# Altium schematic sheet Column.SchDoc
size 420 x 297 mm; Address1: Address1; Address2: Address2; Address3: Address3; Address4: Address4; DocumentNumber: *Э3; SheetNumber: 11; SheetTotal: 15; DocumentType: Схема электрическая *
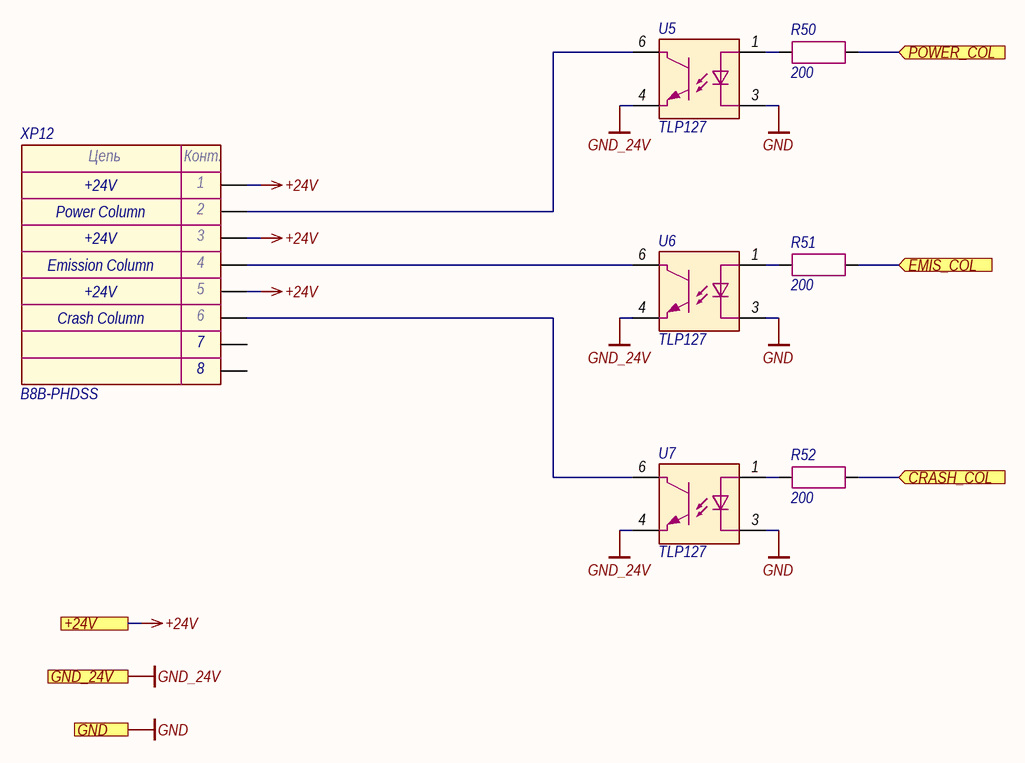
[diagram p0: Column.SchDoc]

## Parts
R50  200  [RES_0603]
R51  200  [RES_0603]
R52  200  [RES_0603]
U5  TLP127  [11-4C1]
U6  TLP127  [11-4C1]
U7  TLP127  [11-4C1]
XP12  B8B-PHDSS  [B8B-PHDSS]

## Ports
+24V (see Main[1C], Button[1C], Flow_sensor[2C], Hardwiring[3C], Indication[1C], LD_driver[1C], Power_supply[1D], Power_supply_CAN[1D]), CRASH_COL (in, see Main[1C]), EMIS_COL (in, see Main[1C]), GND (see Main[1C], Button[1D], Ethernet[3D], Fiber_interlock[2C], Flow_sensor[2C], Guide_laser[1C], Hardwiring[3D], Indication[1C], LD_driver[1D], Power_supply[1D], Power_supply_CAN[1D], SF_driver[2D]), GND_24V (see Main[1C], Button[1D], Flow_sensor[2C], Hardwiring[3C], Indication[1C], LD_driver[1D], Power_supply[1D], Power_supply_CAN[1D]), POWER_COL (in, see Main[1C])

## Nets
+24V: XP12.1 XP12.3 XP12.5 ; port +24V
GND: U5.3 U6.3 U7.3 ; port GND
GND_24V: U5.4 U6.4 U7.4 ; port GND_24V
CRASH_COL: R52.2 ; port CRASH_COL
EMIS_COL: R51.2 ; port EMIS_COL
POWER_COL: R50.2 ; port POWER_COL
NetR50_1: R50.1 U5.1
NetR51_1: R51.1 U6.1
NetR52_1: R52.1 U7.1
NetU5_6: U5.6 XP12.2
NetU6_6: U6.6 XP12.4
NetU7_6: U7.6 XP12.6

Not connected (* = marked no-connect by the designer): XP12 7 8

## Notes on the sheet
- Power Column
- +24V
- Emission Column
- Crash Column
- Подп. и дата
- Инв. № дубл.
- Взам. инв. №
- Инв. № подл.
- Изм.
- Лист
- № докум.
- Подп.
- Дата
- Копировал
- Формат А3
- (in symbol Connector-8) Цепь; Конт.

## Library data of the parts
R50-R52 = Resistor: Manufacturer: Yageo; Model: RC0603FR-07200RL; Value: 200; Document: *
U5-U7 = TLP127: Manufacturer: Toshiba; Model: TLP127; Document: *
XP12 = Connector-8: Manufacturer: JST; Model: B8B-PHDSS; Document: *